# Altium schematic sheet RT-Polit.SchDoc
size A3
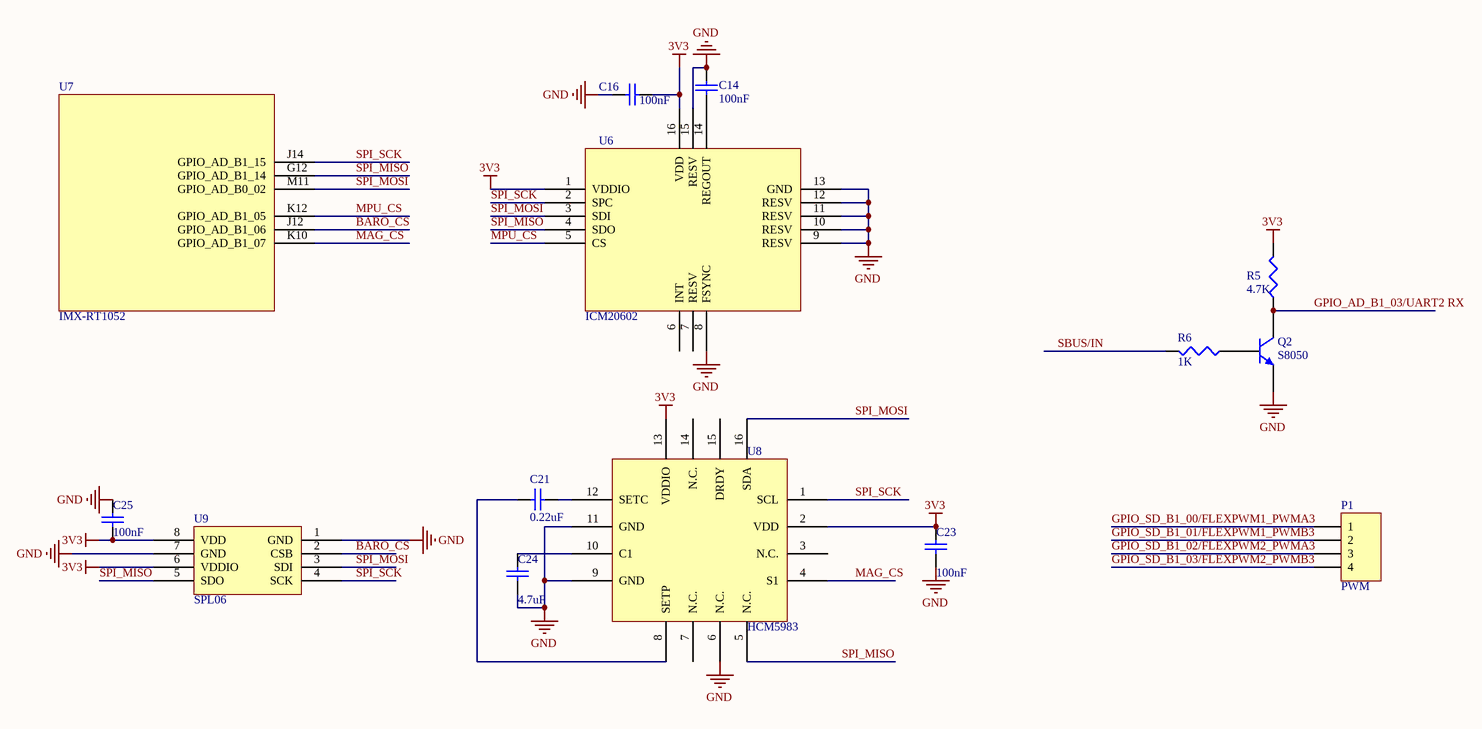
[diagram p0: RT-Polit.SchDoc]

## Parts
C14  100nF  [C0402]
C16  100nF  [C0402]
C21  0.22uF  [C0402]
C23  100nF  [C0402]
C24  4.7uF  [C0402]
C25  100nF  [C0402]
P1  PWM  [HDR1X4H]
Q2  S8050  [SOT23]
R5  4.7K  [0603]
R6  1K  [0603]
U6  ICM20602  [QFN24]
U7  IMX-RT1052  [QFN24]
U8  HCM5983  [LCC16_HMC5883]
U9  SPL06  [MS5611-01BA]

## Nets
3V3: C16.2 C23.1 C25.2 R5.2 U6.1(VDDIO) U6.16(VDD) U8.2(VDD) U8.13(VDDIO) U9.6(VDDIO) U9.8(VDD)
GND: C14.2 C16.1 C23.2 C24.2 C25.1 Q2.2(E) U6.8(FSYNC) U6.9(RESV) U6.10(RESV) U6.11(RESV) U6.12(RESV) U6.13(GND) U6.15(RESV) U8.6(N.C.) U8.9(GND) U8.11(GND) U9.1(GND) U9.7(GND)
BARO_CS: U7.J12(GPIO_AD_B1_06) U9.2(CSB)
GPIO_AD_B1_03/UART2 RX: Q2.3(C) R5.1
GPIO_SD_B1_00/FLEXPWM1_PWMA3: P1.1
GPIO_SD_B1_01/FLEXPWM1_PWMB3: P1.2
GPIO_SD_B1_02/FLEXPWM2_PWMA3: P1.3
GPIO_SD_B1_03/FLEXPWM2_PWMB3: P1.4
MAG_CS: U7.K10(GPIO_AD_B1_07) U8.4(S1)
MPU_CS: U6.5(CS) U7.K12(GPIO_AD_B1_05)
SBUS/IN: R6.2
SPI_MISO: U6.4(SDO) U7.G12(GPIO_AD_B1_14) U8.5(N.C.) U9.5(SDO)
SPI_MOSI: U6.3(SDI) U7.M11(GPIO_AD_B0_02) U8.16(SDA) U9.3(SDI)
SPI_SCK: U6.2(SPC) U7.J14(GPIO_AD_B1_15) U8.1(SCL) U9.4(SCK)
NetC14_1: C14.1 U6.14(REGOUT)
NetC21_1: C21.1 U8.8(SETP)
NetC21_2: C21.2 U8.12(SETC)
NetC24_1: C24.1 U8.10(C1)
NetQ2_1: Q2.1(B) R6.1

Not connected (* = marked no-connect by the designer): U6 6(INT) 7(RESV); U8 3(N.C.) 7(N.C.) 14(N.C.) 15(DRDY)

## Library data of the parts
C14 C16 C23 C25 = Cap Semi: Capacitor (Semiconductor SIM Model); Published: 8-Jun-2000; LatestRevisionDate: 29-May-2009; LatestRevisionNote: IPC-7351 Footprint Added.; PackageReference: C1206; Publisher: Altium Limited; PackageDescription: Chip Capacitor; Value: 100nF
C21 C24 = Cap Semi: Capacitor (Semiconductor SIM Model); Value: 100nF; Published: 8-Jun-2000; LatestRevisionDate: 29-May-2009; LatestRevisionNote: IPC-7351 Footprint Added.; PackageReference: C1206; Publisher: Altium Limited; PackageDescription: Chip Capacitor
P1 = Header 4H: Header, 4-Pin, Right Angle; LatestRevisionDate: 17-Jul-2002; LatestRevisionNote: Re-released for DXP Platform.; Publisher: Altium Limited
Q2 = NPN: NPN General Purpose Amplifier; Published: 8-Jun-2000; LatestRevisionDate: 15-Jan-2003; LatestRevisionNote: PCB Footprint 'BCY-W3/D4.7' replaced; DatasheetVersion: 1997; PackageVersion: Sep-1998; PackageReference: TO-92A; Publisher: Altium Limited; PackageDescription: TO, Flat Index; 3 In-Line, Axial Leads; Body Dia. 4.5mm; Leads 0.51 x 0.48 mm (max); ComponentLink1Description: Manufacturer Link; ComponentLink1URL: http://www.fairchildsemi.com/; ComponentLink2Description: Datasheet; ComponentLink2URL: http://www.fairchildsemi.com/ds/2N%2F2N3904.pdf
R5 R6 = Res3: Resistor; Value: 10K; Published: 8-Jun-2000; LatestRevisionDate: 29-May-2009; LatestRevisionNote: IPC-7351 Footprint Added.; PackageReference: J1-0603; Publisher: Altium Limited; PackageDescription: Chip Resistor
U6 U7 = MPU6000
U8 = HMC5883: HCM5883
U9 = MS5611